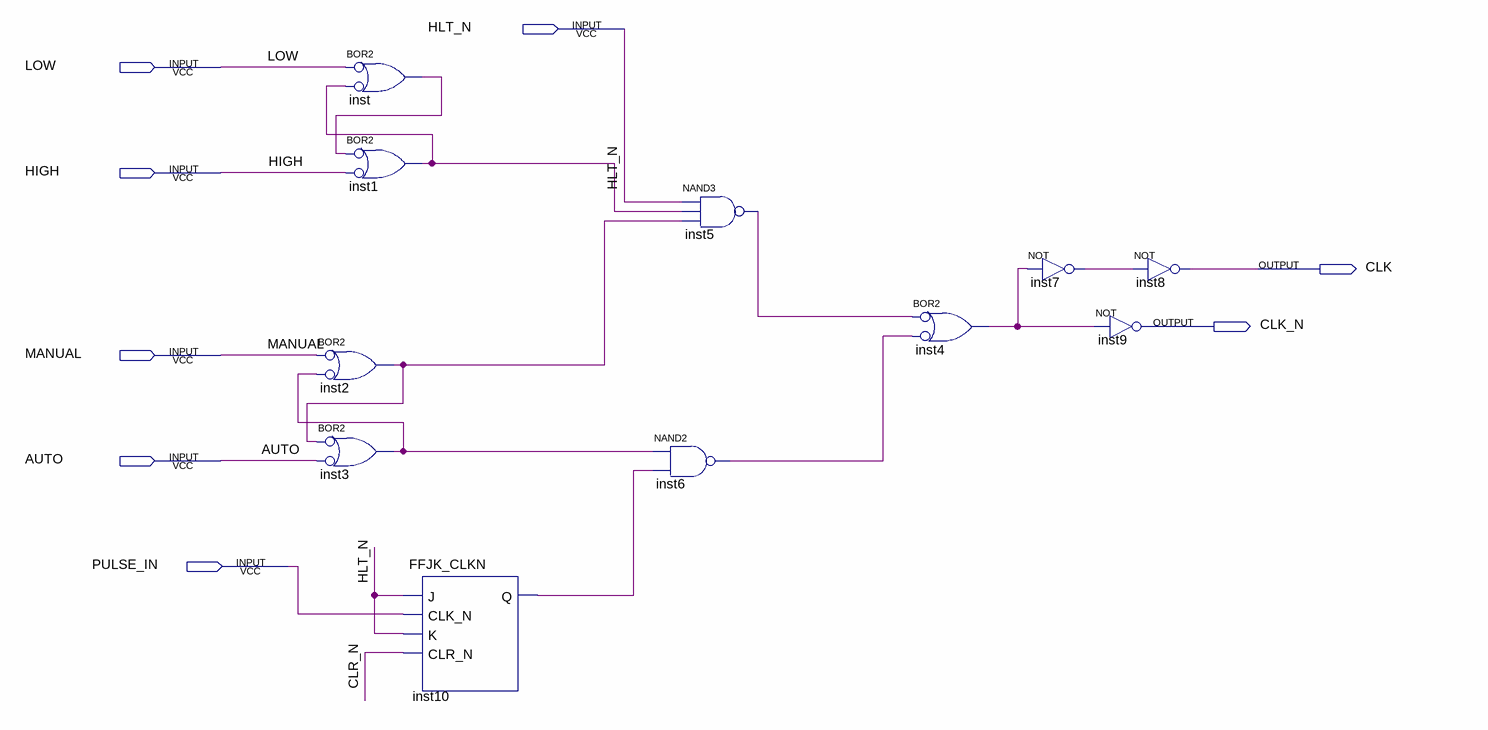
[diagram p0: schematic sheet]
// Quartus schematic GERADOR_CLOCK.bdf as structural Verilog: 11 symbols, 8 pins
module GERADOR_CLOCK (
  input  HLT_N,
  input  LOW,
  input  HIGH,
  input  MANUAL,
  input  AUTO,
  input  PULSE_IN,
  output CLK,
  output CLK_N
);

  wire CLR_N, inst1_out, inst2_out, inst3_out, inst4_out, inst5_out, inst6_out, inst7_out, inst10_q, inst_out;

  or inst (inst_out, ~LOW, ~inst1_out);  // BOR2
  or inst1 (inst1_out, ~inst_out, ~HIGH);  // BOR2
  or inst2 (inst2_out, ~MANUAL, ~inst3_out);  // BOR2
  or inst3 (inst3_out, ~inst2_out, ~AUTO);  // BOR2
  FFJK_CLKN inst10 (.J(HLT_N), .CLK_N(PULSE_IN), .K(HLT_N), .CLR_N(CLR_N), .Q(inst10_q));
  nand inst5 (inst5_out, HLT_N, inst1_out, inst2_out);
  nand inst6 (inst6_out, inst3_out, inst10_q);
  or inst4 (inst4_out, ~inst5_out, ~inst6_out);  // BOR2
  not inst7 (inst7_out, inst4_out);
  not inst8 (CLK, inst7_out);
  not inst9 (CLK_N, inst4_out);
endmodule
